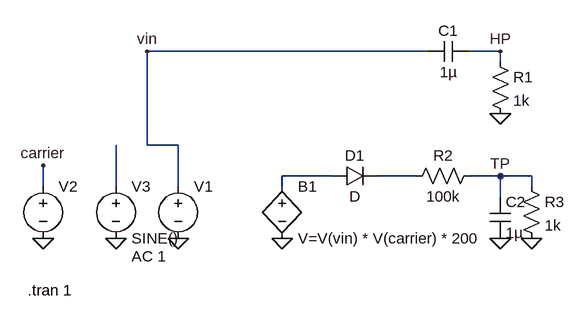
[diagram p0: schematic pc-gen_hplp_mod.asc]
pc-gen_hplp_mod.asc, the LTspice schematic file:
Version 4
SHEET 1 880 680
WIRE 400 -64 -32 -64
WIRE 512 -64 464 -64
WIRE 512 -48 512 -64
WIRE -32 80 -32 -64
WIRE 16 80 -32 80
WIRE 256 128 176 128
WIRE 384 128 320 128
WIRE 512 128 464 128
WIRE 560 128 512 128
WIRE -192 144 -192 112
WIRE -80 144 -80 80
WIRE 16 144 16 80
WIRE 176 144 176 128
WIRE 560 144 560 128
WIRE 512 160 512 128
FLAG 16 224 0
FLAG -192 224 0
FLAG 512 224 0
FLAG 512 32 0
FLAG -192 112 carrier
FLAG -32 -64 vin
FLAG 512 -64 HP
FLAG 512 128 TP
FLAG 176 224 0
FLAG -80 224 0
FLAG 560 224 0
SYMBOL voltage 16 128 R0
WINDOW 3 24 96 Invisible 2
WINDOW 123 0 0 Left 2
WINDOW 39 0 0 Left 2
SYMATTR Value PULSE(0 100 50m 12m 12m 50m 150m)
SYMATTR InstName V1
SYMBOL voltage -192 128 R0
WINDOW 3 24 96 Invisible 2
WINDOW 123 0 0 Left 2
WINDOW 39 0 0 Left 2
SYMATTR Value PULSE(-1 1 0 1n 1n 50u 100u)
SYMATTR InstName V2
SYMBOL bv 176 128 R0
SYMATTR InstName B1
SYMATTR Value V=V(vin) * V(carrier) * 200
SYMBOL res 496 -64 R0
SYMATTR InstName R1
SYMATTR Value 1k
SYMBOL res 368 144 R270
WINDOW 0 32 56 VTop 2
WINDOW 3 0 56 VBottom 2
SYMATTR InstName R2
SYMATTR Value 100k
SYMBOL cap 400 -48 R270
WINDOW 0 32 32 VTop 2
WINDOW 3 0 32 VBottom 2
SYMATTR InstName C1
SYMATTR Value 1µ
SYMBOL cap 496 160 R0
SYMATTR InstName C2
SYMATTR Value 1µ
SYMBOL voltage -80 128 R0
WINDOW 123 24 124 Left 2
WINDOW 39 0 0 Left 2
SYMATTR Value2 AC 1
SYMATTR InstName V3
SYMATTR Value SINE()
SYMBOL diode 256 144 R270
WINDOW 0 32 32 VTop 2
WINDOW 3 0 32 VBottom 2
SYMATTR InstName D1
SYMBOL res 544 128 R0
SYMATTR InstName R3
SYMATTR Value 1k
TEXT -216 304 Left 2 !.tran 1

The netlist it stands for:
* pc-gen_hplp_mod.asc
V1 vin 0 PULSE(0 100 50m 12m 12m 50m 150m)
V2 carrier 0 PULSE(-1 1 0 1n 1n 50u 100u)
B1 N001 0 V=V(vin) * V(carrier) * 200
R1 HP 0 1k
R2 N002 TP 100k
C1 vin HP 1µ
C2 TP 0 1µ
V3 N003 0 SINE() AC 1
D1 N001 N002 D
R3 TP 0 1k
.model D D
.lib standard.dio
.tran 1
.backanno
.end